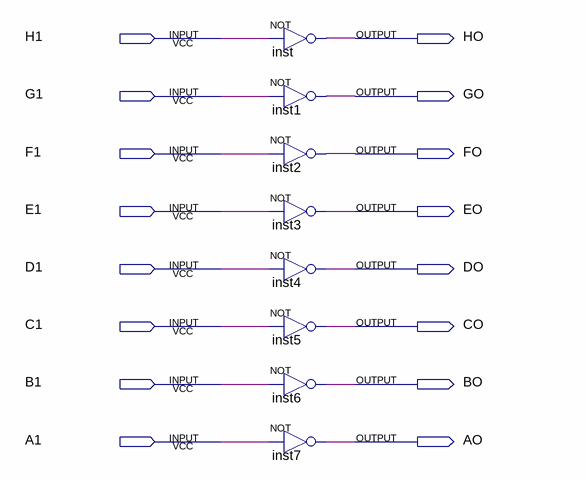
[diagram p0: schematic sheet]
// Quartus schematic NOT.bdf as structural Verilog: 8 symbols, 16 pins
module NOT (
  input  H1,
  input  G1,
  input  F1,
  input  E1,
  input  D1,
  input  C1,
  input  B1,
  input  A1,
  output HO,
  output GO,
  output FO,
  output EO,
  output DO,
  output CO,
  output BO,
  output AO
);

  not inst (HO, H1);
  not inst1 (GO, G1);
  not inst2 (FO, F1);
  not inst3 (EO, E1);
  not inst4 (DO, D1);
  not inst5 (CO, C1);
  not inst6 (BO, B1);
  not inst7 (AO, A1);
endmodule
